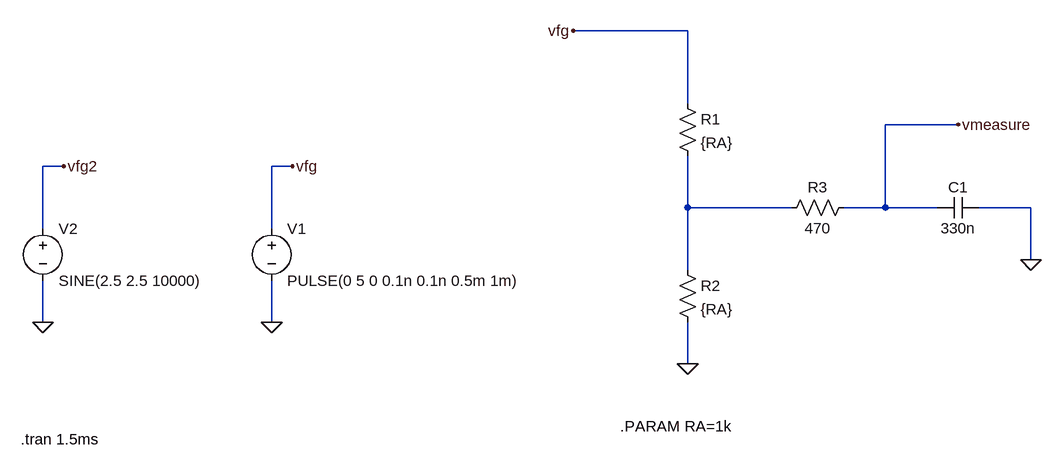
[diagram p0: schematic Task1.asc]
Task1.asc, the LTspice schematic file:
Version 4
SHEET 1 900 680
WIRE 352 -112 176 -112
WIRE 352 0 352 -112
WIRE 768 32 656 32
WIRE -608 96 -640 96
WIRE -256 96 -288 96
WIRE 352 160 352 80
WIRE 512 160 352 160
WIRE 656 160 656 32
WIRE 656 160 592 160
WIRE 736 160 656 160
WIRE 880 160 800 160
WIRE -640 192 -640 96
WIRE -288 192 -288 96
WIRE 880 240 880 160
WIRE 352 256 352 160
WIRE -640 336 -640 272
WIRE -288 336 -288 272
WIRE 352 400 352 336
FLAG -288 336 0
FLAG -640 336 0
FLAG 880 240 0
FLAG 352 400 0
FLAG 768 32 vmeasure
FLAG 176 -112 vfg
FLAG -256 96 vfg
FLAG -608 96 vfg2
SYMBOL voltage -288 176 R0
WINDOW 123 0 0 Left 0
WINDOW 39 0 0 Left 0
SYMATTR InstName V1
SYMATTR Value PULSE(0 5 0 0.1n 0.1n 0.5m 1m)
SYMBOL voltage -640 176 R0
WINDOW 123 0 0 Left 0
WINDOW 39 0 0 Left 0
SYMATTR InstName V2
SYMATTR Value SINE(2.5 2.5 10000)
SYMBOL res 336 -16 R0
SYMATTR InstName R1
SYMATTR Value {RA}
SYMBOL res 336 240 R0
SYMATTR InstName R2
SYMATTR Value {RA}
SYMBOL res 608 144 R90
WINDOW 0 0 56 VBottom 2
WINDOW 3 32 56 VTop 2
SYMATTR InstName R3
SYMATTR Value 470
SYMBOL cap 800 144 R90
WINDOW 0 0 32 VBottom 2
WINDOW 3 32 32 VTop 2
SYMATTR InstName C1
SYMATTR Value 330n
TEXT 248 496 Left 2 !.PARAM RA=1k
TEXT -674 516 Left 2 !.tran 1.5ms

The netlist it stands for:
* Task1.asc
V1 vfg 0 PULSE(0 5 0 0.1n 0.1n 0.5m 1m)
V2 vfg2 0 SINE(2.5 2.5 10000)
R1 vfg N001 {RA}
R2 N001 0 {RA}
R3 vmeasure N001 470
C1 0 vmeasure 330n
.PARAM RA=1k
.tran 1.5ms
.backanno
.end